# EasyEDA schematic circuit.json
TITLE: IR emitter; REV: 1.0; Date: 2021-05-01; Sheet: 1/1; Company: kserin
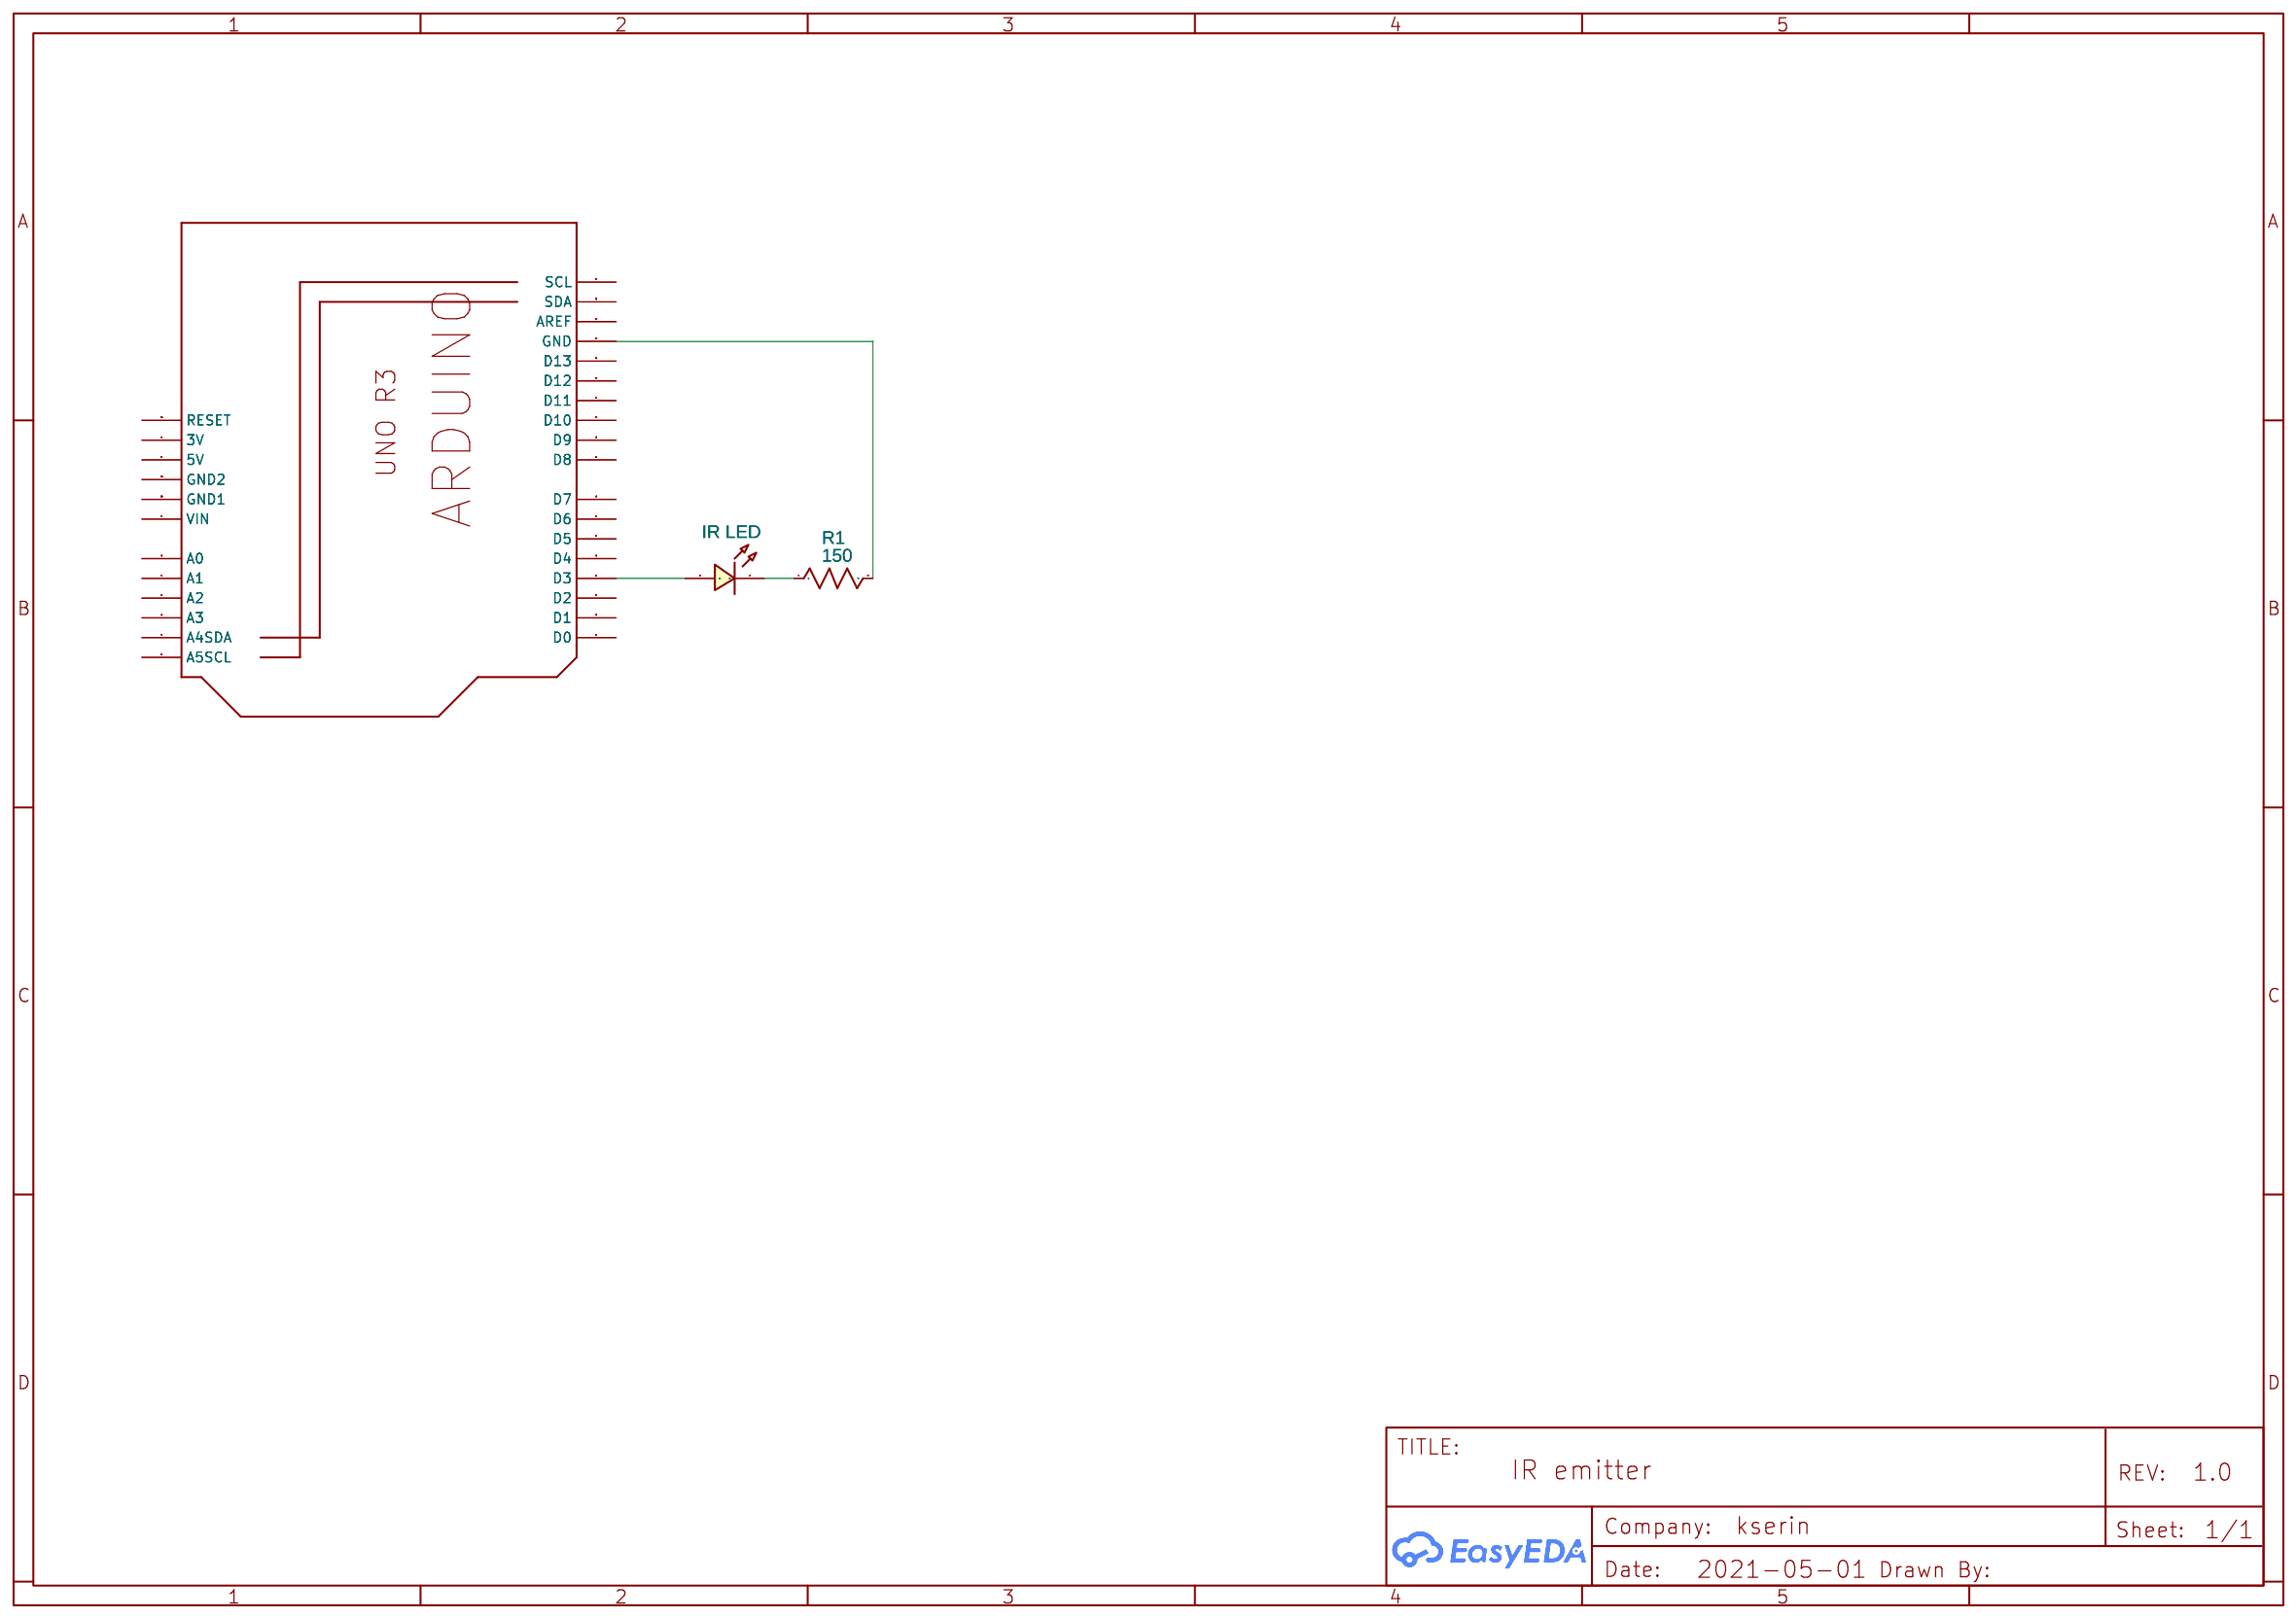
[diagram p0: schematic sheet]

## Parts
LED1  IR LED  [LED0603_RED]
Q1  ARDUINOR3-NOIOREF-NOTEXT  [ARDUINOR3-NOTEXT-NOIOREF]
R1  150  [R0603]

## Library data of the parts
LED1 = LED-0603_R: Manufacturer: EVERLIGHT(台湾亿光); Manufacturer Part: 19-217/R6C-AL1M2VY/3T; Supplier Part: C72044; Supplier: LCSC; Contributor: LCEDA_01
Q1 = ARDUINOR3-NOIOREF-NOTEXT: Contributor: Adafruit
R1 = R_0603_US: Contributor: LCEDA_Lib

## Nets
Net-(LED1-1): LED1.1 Q1.D3
Net-(LED1-2): LED1.2 R1.1
Net-(Q1-GND): Q1.GND R1.2

Not connected (* = marked no-connect by the designer): Q1 3V 5V A0 A1 A2 A3 A4(A4SDA) A5(A5SCL) AREF D0 D1 D2 D4 D5 D6 D7 D8 D9 D10 D11 D12 D13 GND1 GND2 RESET SCL SDA VIN
